# Altium schematic sheet Heaters.SchDoc
size A
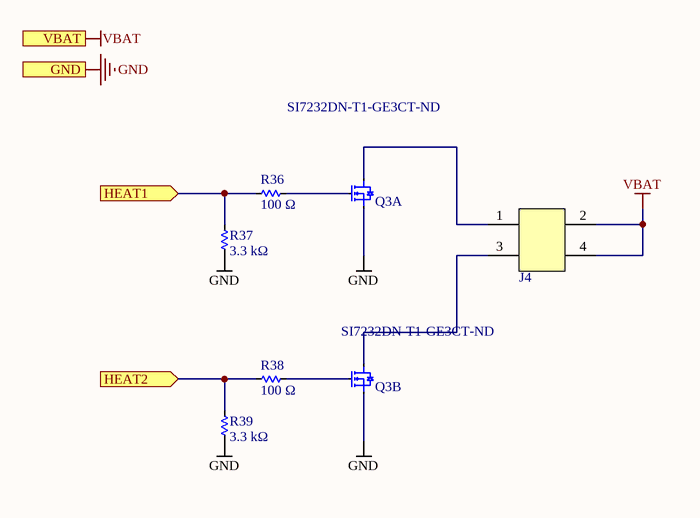
[diagram p0: Heaters.SchDoc]

## Parts
J4  CONN_2X2_Harwin_M80-5T104  [Harwin M80-5T104]  (value not drawn)
Q3  Supplier Part Number 1: SI7232DN-T1-GE3CT-ND  [POWERPAK_1212-8_DUAL]  (hidden comment: NFET_SI7232DN)  (parts A,B of 2)
R36  Resistance: 100 Ω  [R0603]  (hidden comment: __template_resistor)
R37  Resistance: 3.3 kΩ  [R0603]  (hidden comment: __template_resistor)
R38  Resistance: 100 Ω  [R0603]  (hidden comment: __template_resistor)
R39  Resistance: 3.3 kΩ  [R0603]  (hidden comment: __template_resistor)

## Ports
GND (in), HEAT1 (in), HEAT2 (in), VBAT (in)

## Nets
GND: Q3.1 Q3.3 R37.1 R39.1 ; port GND
VBAT: J4.2 J4.4 ; port VBAT
HEAT1: R36.1 R37.2 ; port HEAT1
HEAT2: R38.1 R39.2 ; port HEAT2
NetJ4_1: J4.1 Q3.7
NetJ4_3: J4.3 Q3.5
NetQ3_2: Q3.2 R36.2
NetQ3_4: Q3.4 R38.2

## Library data of the parts
Q3 = NFET_SI7232DN: MOSFET 2N-CH 20V 25A PPAK 1212-8; Manufacturer: Vishay Siliconix; Manufacturer Part Number: SI7232DN-T1-GE3; FET Type: 2 N-Channel (Dual); FET Feature: Logic Level Gate; Rds On (Max) @ Id, Vgs: 16.4 mOhm @ 10A, 4.5V; Vgs(th) (Max) @ Id: 1V @ 250µA; Gate Charge (Qg) @ Vgs: 32nC @ 8V; Input Capacitance (Ciss) @ Vds: 1220pF @ 10V; Power - Max: 23W; Supplier 1: Digi-Key; RoHS: RoHS Compliant; Category: Discrete Semiconductor Products; Stock 1: 2311; Pricing 1: 1=0.89, 10=0.782, 25=0.7344, 100=0.5994, 250=0.55672, 500=0.4738, 1000=0.37904 (USD); Packaging: Cut Tape (CT); Drain to Source Voltage (Vdss): 20V; Current - Continuous Drain (Id) @ 25°C: 25A; Operating Temperature: -55°C ~ 150°C (TJ); Mounting Type: Surface Mount; Package / Case: PowerPAK® 1212-8 Dual; Supplier Device Package: PowerPAK® 1212-8 Dual; ComponentLink1URL: http://www.vishay.com/docs/68986/si7232dn.pdf; ComponentLink1Description: http://www.vishay.com/docs/68986/si7232dn.pdf; Part Status: Active
R36 R38 = 311-100HRCT-ND: RES SMD 100 OHM 1% 1/10W 0603; Manufacturer Part Number: RC0603FR-07100RL; Manufacturer: Yageo; Power (Watts): 0.1W, 1/10W; Resistance (Sortable): 100; Temperature Coefficient: ±100ppm/°C; Tolerance: ±1%; Supplier Part Number 1: 311-100HRCT-ND; Supplier 1: Digikey; Datasheets: http://www.yageo.com/documents/recent/PYu-RC_Group_51_RoHS_L_9.pdf; Image: //media.digikey.com/Renders/Yageo%20Renders/0603-(1608-Metric).jpg; Operating Temperature: -55°C ~ 155°C
R37 R39 = 311-3.30KHRCT-ND: RES SMD 3.3K OHM 1% 1/10W 0603; Manufacturer Part Number: RC0603FR-073K3L; Manufacturer: Yageo; Power (Watts): 0.1W, 1/10W; Resistance (Sortable): 3300; Temperature Coefficient: ±100ppm/°C; Tolerance: ±1%; Supplier Part Number 1: 311-3.30KHRCT-ND; Supplier 1: Digikey; Datasheets: http://www.yageo.com/documents/recent/PYu-RC_Group_51_RoHS_L_9.pdf; Image: //media.digikey.com/Renders/Yageo%20Renders/0603-(1608-Metric).jpg; Operating Temperature: -55°C ~ 155°C